# Altium schematic sheet stm32n657.SchDoc
size C
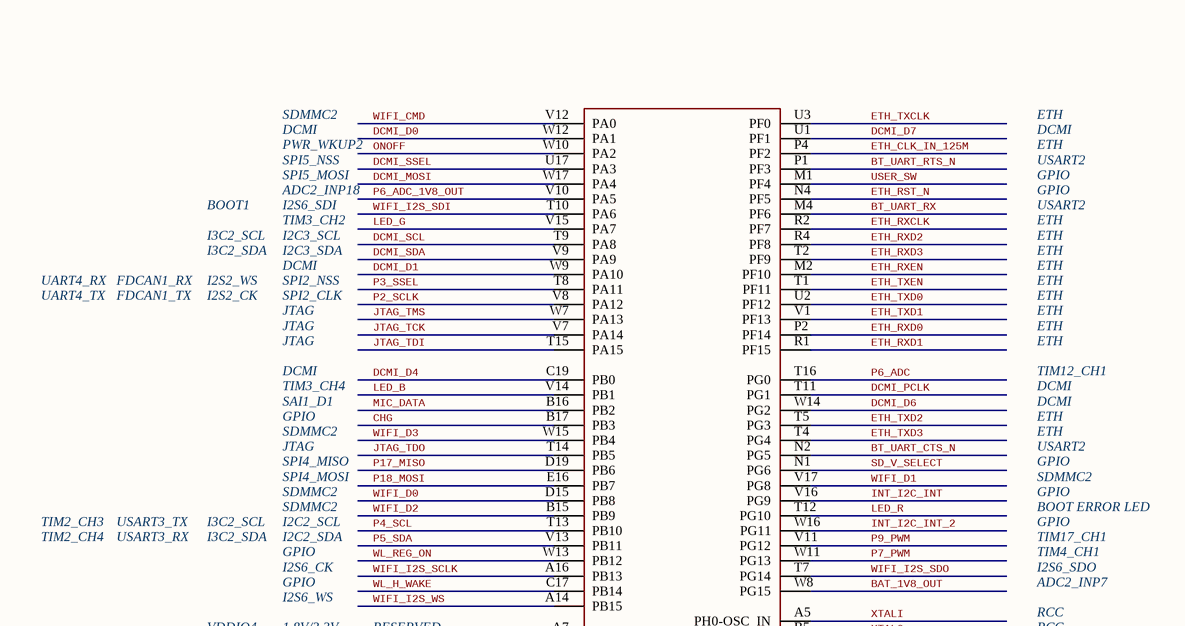
[diagram p0: stm32n657.SchDoc, top left]
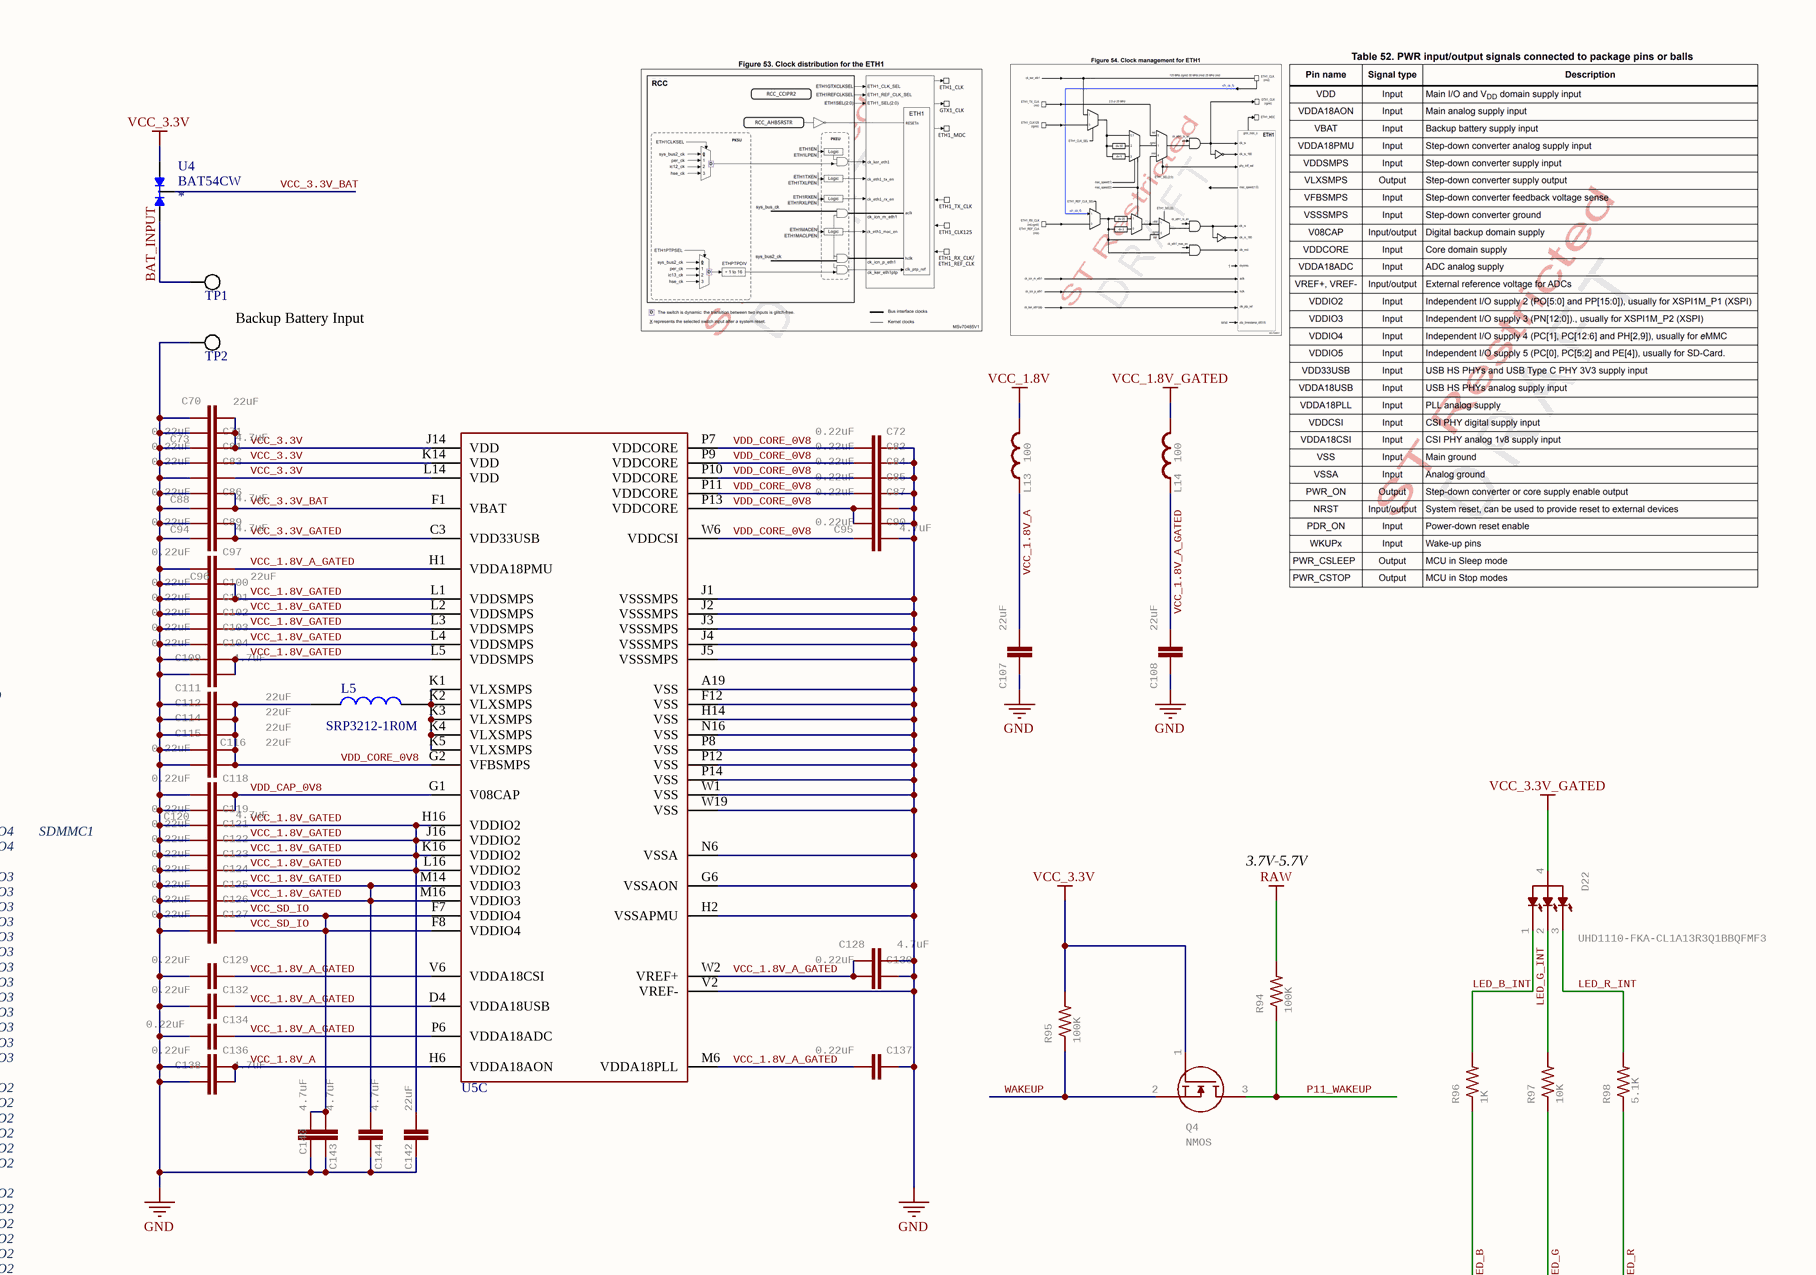
[diagram p1: stm32n657.SchDoc, top right]
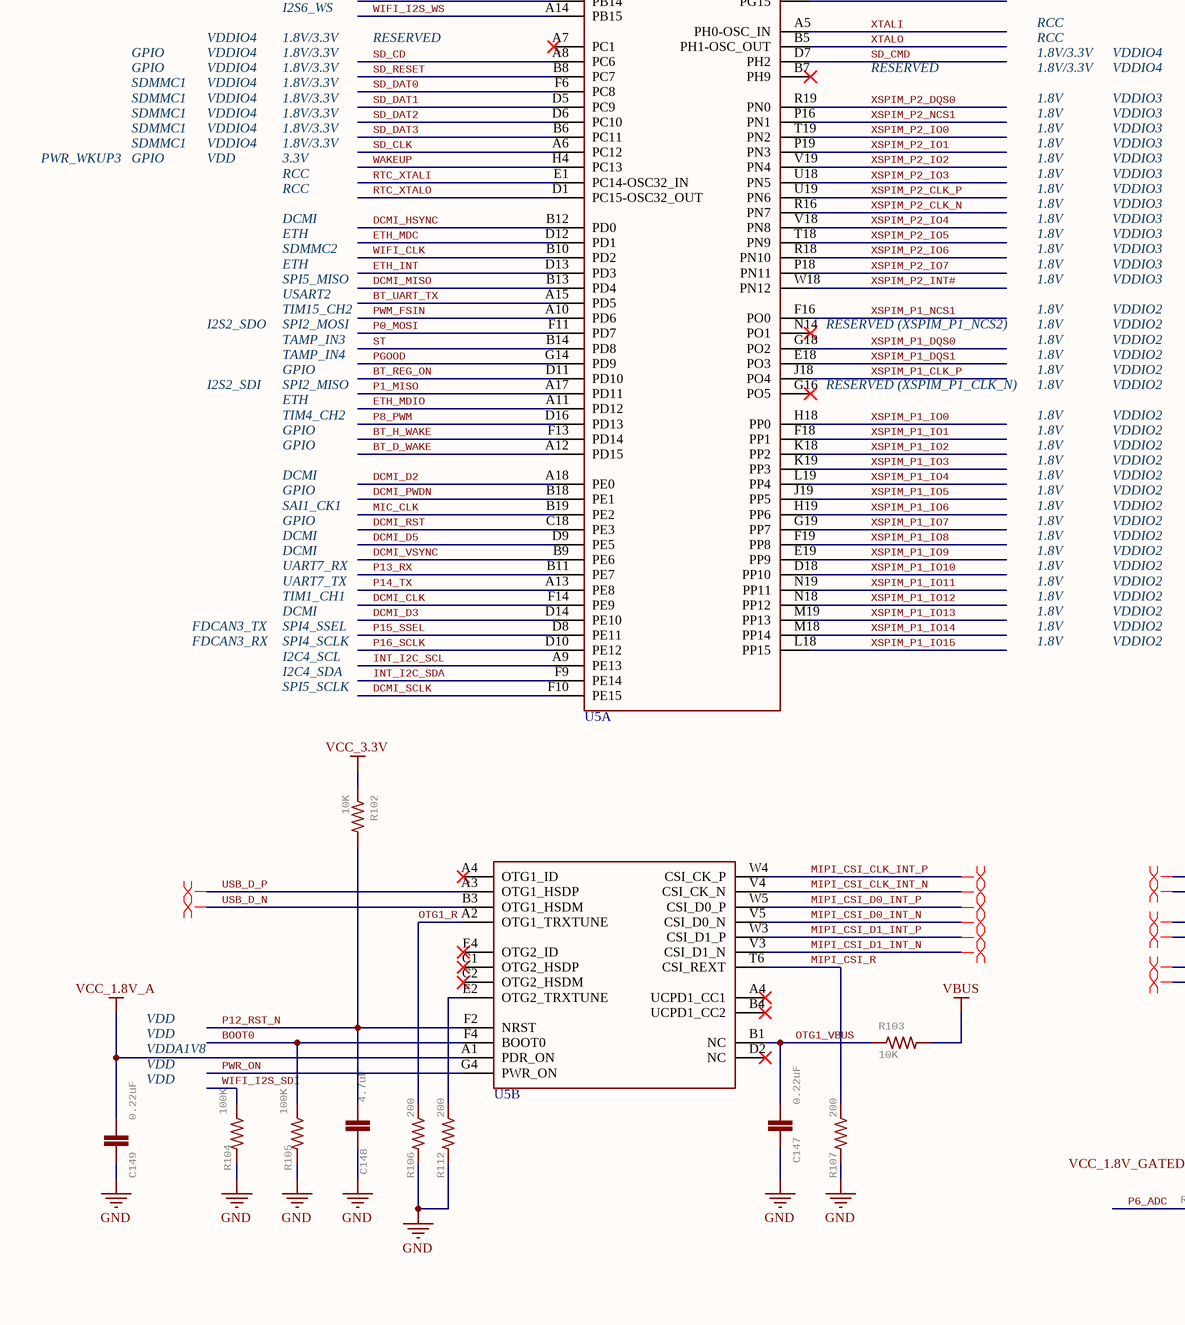
[diagram p2: stm32n657.SchDoc, bottom left]
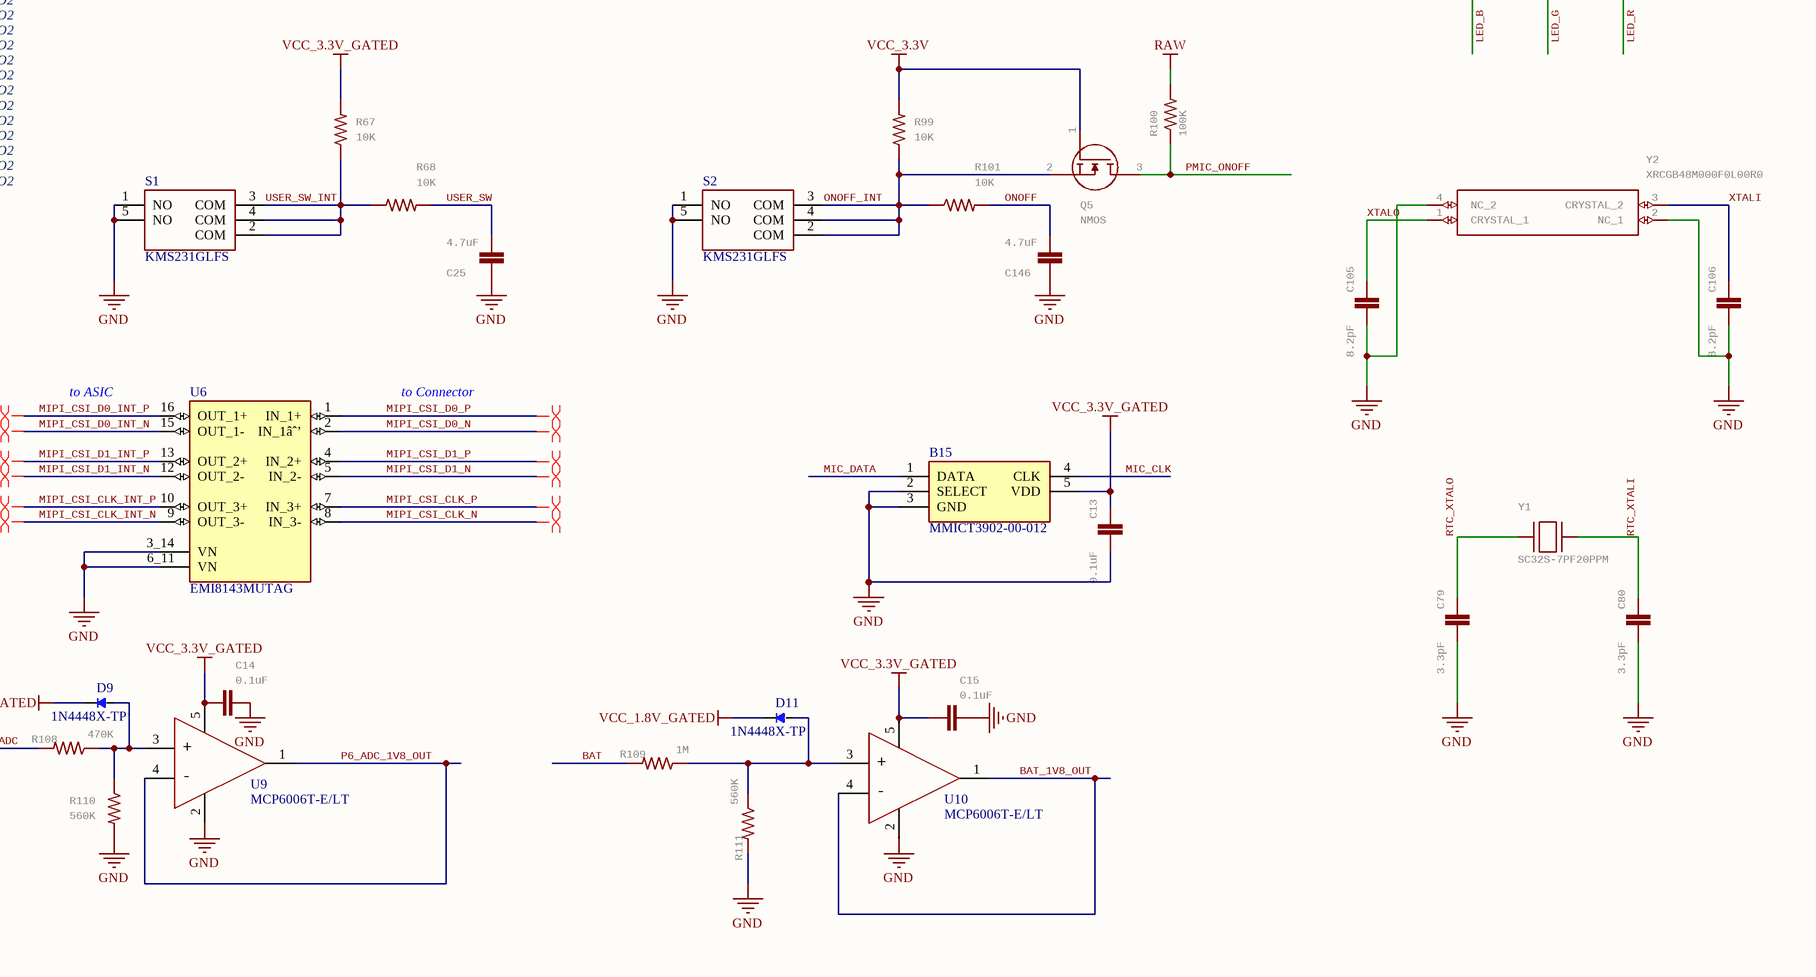
[diagram p3: stm32n657.SchDoc, bottom right]

## Parts
B15  MMICT3902-00-012  [MMICT390200012]
C13  0.1uF  [0402-CAP]
C14  0.1uF  [0402-CAP]
C15  0.1uF  [0402-CAP]
C25  4.7uF  [0402-CAP]
C70  22uF  [0805]
C71  0.22uF  [C0201]
C72  0.22uF  [C0201]
C73  4.7uF  [0402-CAP]
C79  3.3pF  [C0201]
C80  3.3pF  [C0201]
C81  0.22uF  [C0201]
C82  0.22uF  [C0201]
C83  0.22uF  [C0201]
C84  0.22uF  [C0201]
C85  0.22uF  [C0201]
C86  0.22uF  [C0201]
C87  0.22uF  [C0201]
C88  4.7uF  [0402-CAP]
C89  0.22uF  [C0201]
C90  0.22uF  [C0201]
C94  4.7uF  [0402-CAP]
C95  4.7uF  [0402-CAP]
C96  22uF  [0805]
C97  0.22uF  [C0201]
C100  0.22uF  [C0201]
C101  0.22uF  [C0201]
C102  0.22uF  [C0201]
C103  0.22uF  [C0201]
C104  0.22uF  [C0201]
C105  8.2pF  [C0201]
C106  8.2pF  [C0201]
C107  22uF  [0805]
C108  22uF  [0805]
C109  4.7uF  [0402-CAP]
C111  22uF  [0805]
C112  22uF  [0805]
C114  22uF  [0805]
C115  22uF  [0805]
C116  0.22uF  [C0201]
C118  0.22uF  [C0201]
C119  0.22uF  [C0201]
C120  4.7uF  [0402-CAP]
C121  0.22uF  [C0201]
C122  0.22uF  [C0201]
C123  0.22uF  [C0201]
C124  0.22uF  [C0201]
C125  0.22uF  [C0201]
C126  0.22uF  [C0201]
C127  0.22uF  [C0201]
C128  4.7uF  [0402-CAP]
C129  0.22uF  [C0201]
C130  0.22uF  [C0201]
C132  0.22uF  [C0201]
C134  0.22uF  [C0201]
C136  0.22uF  [C0201]
C137  0.22uF  [C0201]
C138  4.7uF  [0402-CAP]
C140  4.7uF  [0402-CAP]
C142  22uF  [0805]
C143  4.7uF  [0402-CAP]
C144  4.7uF  [0402-CAP]
C146  4.7uF  [0402-CAP]
C147  0.22uF  [C0201]
C148  4.7uF  [0402-CAP]
C149  0.22uF  [C0201]
D9  MPN: 1N4448X-TP  [SOD523]  (hidden comment: DIODE_GP)
D11  MPN: 1N4448X-TP  [SOD523]  (hidden comment: DIODE_GP)
D22  UHD1110-FKA-CL1A13R3Q1BBQFMF3  [LED_UHD1110-FKA-CL1A13R3Q1BBQFMF3]
L5  SRP3212-1R0M  [IND3225X100N]
L13  100  [C0402]
L14  100  [C0402]
Q4  NMOS  [DFN1006]
Q5  NMOS  [DFN1006]
R67  10K  [0402-RES]
R68  10K  [0402-RES]
R94  100K  [0402-RES]
R95  100K  [0402-RES]
R96  1K  [0402-RES]
R97  10K  [0402-RES]
R98  5.1K  [0402-RES]
R99  10K  [0402-RES]
R100  100K  [0402-RES]
R101  10K  [0402-RES]
R102  10K  [0402-RES]
R103  10K  [0402-RES]
R104  100K  [0402-RES]
R105  100K  [0402-RES]
R106  200  [R0201]
R107  200  [R0201]
R108  470K  [0402-RES]
R109  1M  [0402-RES]
R110  560K  [0402-RES]
R111  560K  [0402-RES]
R112  200  [R0201]
S1  KMS231GLFS  [KMS231GLFS]
S2  KMS231GLFS  [KMS231GLFS]
TP1  TP  [TP_1p8]  (value not drawn)  (no BOM)
TP2  TP  [TP_1p8]  (value not drawn)  (no BOM)
U4  BAT54CW  [SOT65P210X110-3N]
U5  STM32N657_223  [STM32N657_VFBGA223]  (value not drawn)  (parts A,B,C of 3)
U6  EMI8143MUTAG  [IC_EMI8143MUTAG]
U9  MCP6006T-E/LT  [SC70-5]
U10  MCP6006T-E/LT  [SC70-5]
Y1  SC32S-7PF20PPM  [XTAL_ABS07-32.768KHZ-7-T]
Y2  XRCGB48M000F0L00R0  [XRCGB24M000F3M00R0]

## Nets
GND: B15.2(SELECT) B15.3(GND) C13.2 C14.2 C15.2 C25.1 C70.1 C71.2 C72.1 C73.2 C79.2 C80.2 C81.2 C82.1 C83.2 C84.1 C85.1 C86.2 C87.1 C88.2 C89.2 C90.1 C94.2 C95.1 C96.1 C97.2 C100.2 C101.2 C102.2 C103.2 C104.2 C105.2 C106.2 C107.1 C108.1 C109.1 C111.1 C112.1 C114.1 C115.1 C116.2 C118.2 C119.2 C120.2 C121.2 C122.2 C123.2 C124.2 C125.2 C126.2 C127.2 C128.2 C129.2 C130.1 C132.2 C134.2 C136.2 C137.1 C138.1 C140.2 C142.1 C143.2 C144.2 C146.1 C147.1 C148.2 C149.1 R104.2 R105.2 R106.2 R107.2 R110.2 R111.2 R112.2 S1.1(NO) S1.5(NO) S2.1(NO) S2.5(NO) TP2.1 U5.A19(VSS) U5.F12(VSS) U5.G6(VSSAON) U5.H2(VSSAPMU) U5.H14(VSS) U5.J1(VSSSMPS) U5.J2(VSSSMPS) U5.J3(VSSSMPS) U5.J4(VSSSMPS) U5.J5(VSSSMPS) U5.N6(VSSA) U5.N16(VSS) U5.P8(VSS) U5.P12(VSS) U5.P14(VSS) U5.V2(VREF-) U5.W1(VSS) U5.W19(VSS) U6.3_14(VN) U6.6_11(VN) U9.2(GND) U10.2(GND) Y2.2(NC_1) Y2.4(NC_2)
RAW: R94.2 R100.2
VBUS: R103.2
VCC_1.8V: L13.2
VCC_1.8V_A: C107.2 C136.1 C138.2 C149.2 L13.1 U5.A1(PDR_ON) U5.H6(VDDA18AON)
VCC_1.8V_GATED: C96.2 C100.1 C101.1 C102.1 C103.1 C104.1 C109.2 C119.1 C121.1 C122.1 C123.1 C124.1 C125.1 C142.2 C144.1 D9.1 D11.1 L14.2 U5.H16(VDDIO2) U5.J16(VDDIO2) U5.K16(VDDIO2) U5.L1(VDDSMPS) U5.L2(VDDSMPS) U5.L3(VDDSMPS) U5.L4(VDDSMPS) U5.L5(VDDSMPS) U5.L16(VDDIO2) U5.M14(VDDIO3) U5.M16(VDDIO3)
VCC_3.3V: C70.2 C71.1 C73.1 C81.1 C83.1 Q4.1(G) Q5.1(G) R95.2 R99.2 R102.1 U4.1 U5.J14(VDD) U5.K14(VDD) U5.L14(VDD)
VCC_3.3V_GATED: B15.5(VDD) C13.1 C14.1 C15.1 C89.1 C94.1 D22.4(ANODE) R67.2 U5.C3(VDD33USB) U9.5(VDD) U10.5(VDD)
BAT: R109.2
BAT_1V8_OUT: U5.W8(PG15) U10.1(OUT) U10.4(IN-)
BAT_INPUT: TP1.1 U4.2
BOOT0: R105.1 U5.F4(BOOT0)
BT_D_WAKE: U5.A12(PD15)
BT_H_WAKE: U5.F13(PD14)
BT_REG_ON: U5.D11(PD10)
BT_UART_CTS_N: U5.N2(PG5)
BT_UART_RTS_N: U5.P1(PF3)
BT_UART_RX: U5.M4(PF6)
BT_UART_TX: U5.A15(PD5)
CHG: U5.B17(PB3)
DCMI_CLK: U5.F14(PE9)
DCMI_D0: U5.W12(PA1)
DCMI_D1: U5.W9(PA10)
DCMI_D2: U5.A18(PE0)
DCMI_D3: U5.D14(PE10)
DCMI_D4: U5.C19(PB0)
DCMI_D5: U5.D9(PE5)
DCMI_D6: U5.W14(PG2)
DCMI_D7: U5.U1(PF1)
DCMI_HSYNC: U5.B12(PD0)
DCMI_MISO: U5.B13(PD4)
DCMI_MOSI: U5.W17(PA4)
DCMI_PCLK: U5.T11(PG1)
DCMI_PWDN: U5.B18(PE1)
DCMI_RST: U5.C18(PE3)
DCMI_SCL: U5.T9(PA8)
DCMI_SCLK: U5.F10(PE15)
DCMI_SDA: U5.V9(PA9)
DCMI_SSEL: U5.U17(PA3)
DCMI_VSYNC: U5.B9(PE6)
ETH_CLK_IN_125M: U5.P4(PF2)
ETH_INT: U5.D13(PD3)
ETH_MDC: U5.D12(PD1)
ETH_MDIO: U5.A11(PD12)
ETH_RST_N: U5.N4(PF5)
ETH_RXCLK: U5.R2(PF7)
ETH_RXD0: U5.P2(PF14)
ETH_RXD1: U5.R1(PF15)
ETH_RXD2: U5.R4(PF8)
ETH_RXD3: U5.T2(PF9)
ETH_RXEN: U5.M2(PF10)
ETH_TXCLK: U5.U3(PF0)
ETH_TXD0: U5.U2(PF12)
ETH_TXD1: U5.V1(PF13)
ETH_TXD2: U5.T5(PG3)
ETH_TXD3: U5.T4(PG4)
ETH_TXEN: U5.T1(PF11)
INT_I2C_INT: U5.V16(PG9)
INT_I2C_INT_2: U5.W16(PG11)
INT_I2C_SCL: U5.A9(PE13)
INT_I2C_SDA: U5.F9(PE14)
JTAG_TCK: U5.V7(PA14)
JTAG_TDI: U5.T15(PA15)
JTAG_TDO: U5.T14(PB5)
JTAG_TMS: U5.W7(PA13)
LED_B: R96.1 U5.V14(PB1)
LED_B_INT: D22.1(BLUE) R96.2
LED_G: R97.1 U5.V15(PA7)
LED_G_INT: D22.2(GREEN) R97.2
LED_R: R98.1 U5.T12(PG10)
LED_R_INT: D22.3(RED) R98.2
MIC_CLK: B15.4(CLK) U5.B19(PE2)
MIC_DATA: B15.1(DATA) U5.B16(PB2)
MIPI_CSI_CLK_INT_N: U5.V4(CSI_CK_N) U6.9(OUT_3-)
MIPI_CSI_CLK_INT_P: U5.W4(CSI_CK_P) U6.10(OUT_3+)
MIPI_CSI_CLK_N: U6.8(IN_3-)
MIPI_CSI_CLK_P: U6.7(IN_3+)
MIPI_CSI_D0_INT_N: U5.V5(CSI_D0_N) U6.15(OUT_1-)
MIPI_CSI_D0_INT_P: U5.W5(CSI_D0_P) U6.16(OUT_1+)
MIPI_CSI_D0_N: U6.2(IN_1âˆ’)
MIPI_CSI_D0_P: U6.1(IN_1+)
MIPI_CSI_D1_INT_N: U5.V3(CSI_D1_N) U6.12(OUT_2-)
MIPI_CSI_D1_INT_P: U5.W3(CSI_D1_P) U6.13(OUT_2+)
MIPI_CSI_D1_N: U6.5(IN_2-)
MIPI_CSI_D1_P: U6.4(IN_2+)
MIPI_CSI_R: R107.1 U5.T6(CSI_REXT)
ONOFF: C146.2 R101.2 U5.W10(PA2)
ONOFF_INT: Q5.2(S) R99.1 R101.1 S2.2(COM) S2.3(COM) S2.4(COM)
OTG1_R: R106.1 U5.A2(OTG1_TRXTUNE)
OTG1_VBUS: C147.2 R103.1 U5.B1(NC)
P0_MOSI: U5.F11(PD7)
P1_MISO: U5.A17(PD11)
P2_SCLK: U5.V8(PA12)
P3_SSEL: U5.T8(PA11)
P4_SCL: U5.T13(PB10)
P5_SDA: U5.V13(PB11)
P6_ADC: R108.2 U5.T16(PG0)
P6_ADC_1V8_OUT: U5.V10(PA5) U9.1(OUT) U9.4(IN-)
P7_PWM: U5.W11(PG13)
P8_PWM: U5.D16(PD13)
P9_PWM: U5.V11(PG12)
P11_WAKEUP: Q4.3(D) R94.1
P12_RST_N: C148.1 R102.2 U5.F2(NRST)
P13_RX: U5.B11(PE7)
P14_TX: U5.A13(PE8)
P15_SSEL: U5.D8(PE11)
P16_SCLK: U5.D10(PE12)
P17_MISO: U5.D19(PB6)
P18_MOSI: U5.E16(PB7)
PGOOD: U5.G14(PD9)
PMIC_ONOFF: Q5.3(D) R100.1
PWM_FSIN: U5.A10(PD6)
PWR_ON: U5.G4(PWR_ON)
RTC_XTALI: C80.1 U5.E1(PC14-OSC32_IN) Y1.2
RTC_XTALO: C79.1 U5.D1(PC15-OSC32_OUT) Y1.1
SD_CD: U5.A8(PC6)
SD_CLK: U5.A6(PC12)
SD_CMD: U5.D7(PH2)
SD_DAT0: U5.F6(PC8)
SD_DAT1: U5.D5(PC9)
SD_DAT2: U5.D6(PC10)
SD_DAT3: U5.B6(PC11)
SD_RESET: U5.B8(PC7)
SD_V_SELECT: U5.N1(PG6)
ST: U5.B14(PD8)
USB_D_N: U5.B3(OTG1_HSDM)
USB_D_P: U5.A3(OTG1_HSDP)
USER_SW: C25.2 R68.2 U5.M1(PF4)
USER_SW_INT: R67.1 R68.1 S1.2(COM) S1.3(COM) S1.4(COM)
VCC_1.8V_A_GATED: C97.1 C108.2 C128.1 C129.1 C130.2 C132.1 C134.1 C137.2 L14.1 U5.D4(VDDA18USB) U5.H1(VDDA18PMU) U5.M6(VDDA18PLL) U5.P6(VDDA18ADC) U5.V6(VDDA18CSI) U5.W2(VREF+)
VCC_3.3V_BAT: C86.1 C88.1 U4.3 U5.F1(VBAT)
VCC_SD_IO: C126.1 C127.1 C140.1 C143.1 U5.F7(VDDIO4) U5.F8(VDDIO4)
VDD_CAP_0V8: C118.1 C120.1 U5.G1(V08CAP)
VDD_CORE_0V8: C72.2 C82.2 C84.2 C85.2 C87.2 C90.2 C95.2 C111.2 C112.2 C114.2 C115.2 C116.1 L5.1 U5.G2(VFBSMPS) U5.P7(VDDCORE) U5.P9(VDDCORE) U5.P10(VDDCORE) U5.P11(VDDCORE) U5.P13(VDDCORE) U5.W6(VDDCSI)
WAKEUP: Q4.2(S) R95.1 U5.H4(PC13)
WIFI_CLK: U5.B10(PD2)
WIFI_CMD: U5.V12(PA0)
WIFI_D0: U5.D15(PB8)
WIFI_D1: U5.V17(PG8)
WIFI_D2: U5.B15(PB9)
WIFI_D3: U5.W15(PB4)
WIFI_I2S_SCLK: U5.A16(PB13)
WIFI_I2S_SDI: R104.1 U5.T10(PA6)
WIFI_I2S_SDO: U5.T7(PG14)
WIFI_I2S_WS: U5.A14(PB15)
WL_H_WAKE: U5.C17(PB14)
WL_REG_ON: U5.W13(PB12)
XSPIM_P1_CLK_P: U5.J18(PO4)
XSPIM_P1_DQS0: U5.G18(PO2)
XSPIM_P1_DQS1: U5.E18(PO3)
XSPIM_P1_IO0: U5.H18(PP0)
XSPIM_P1_IO1: U5.F18(PP1)
XSPIM_P1_IO2: U5.K18(PP2)
XSPIM_P1_IO3: U5.K19(PP3)
XSPIM_P1_IO4: U5.L19(PP4)
XSPIM_P1_IO5: U5.J19(PP5)
XSPIM_P1_IO6: U5.H19(PP6)
XSPIM_P1_IO7: U5.G19(PP7)
XSPIM_P1_IO8: U5.F19(PP8)
XSPIM_P1_IO9: U5.E19(PP9)
XSPIM_P1_IO10: U5.D18(PP10)
XSPIM_P1_IO11: U5.N19(PP11)
XSPIM_P1_IO12: U5.N18(PP12)
XSPIM_P1_IO13: U5.M19(PP13)
XSPIM_P1_IO14: U5.M18(PP14)
XSPIM_P1_IO15: U5.L18(PP15)
XSPIM_P1_NCS1: U5.F16(PO0)
XSPIM_P2_CLK_N: U5.R16(PN7)
XSPIM_P2_CLK_P: U5.U19(PN6)
XSPIM_P2_DQS0: U5.R19(PN0)
XSPIM_P2_INT#: U5.W18(PN12)
XSPIM_P2_IO0: U5.T19(PN2)
XSPIM_P2_IO1: U5.P19(PN3)
XSPIM_P2_IO2: U5.V19(PN4)
XSPIM_P2_IO3: U5.U18(PN5)
XSPIM_P2_IO4: U5.V18(PN8)
XSPIM_P2_IO5: U5.T18(PN9)
XSPIM_P2_IO6: U5.R18(PN10)
XSPIM_P2_IO7: U5.P18(PN11)
XSPIM_P2_NCS1: U5.P16(PN1)
XTALI: C106.1 U5.A5(PH0-OSC_IN) Y2.3(CRYSTAL_2)
XTALO: C105.1 U5.B5(PH1-OSC_OUT) Y2.1(CRYSTAL_1)
NetD9_2: D9.2 R108.1 R110.1 U9.3(IN+)
NetD11_2: D11.2 R109.1 R111.1 U10.3(IN+)
NetL5_2: L5.2 U5.K1(VLXSMPS) U5.K2(VLXSMPS) U5.K3(VLXSMPS) U5.K4(VLXSMPS) U5.K5(VLXSMPS)
NetR112_1: R112.1 U5.E2(OTG2_TRXTUNE)

Not connected (* = marked no-connect by the designer): U5 A4(UCPD1_CC1)* A7(PC1)* B4(UCPD1_CC2)* B7(PH9)* C1(OTG2_HSDP)* C2(OTG2_HSDM)* D2(NC)* E4(OTG2_ID)* G16(PO5)* N14(PO1)*

## Layout directives
differential pair; differential pair class MIPI: MIPI_CSI_CLK_INT_N, MIPI_CSI_CLK_INT_P, MIPI_CSI_CLK_N, MIPI_CSI_CLK_P, MIPI_CSI_D0_INT_N, MIPI_CSI_D0_INT_P, MIPI_CSI_D0_N, MIPI_CSI_D0_P, MIPI_CSI_D1_INT_N, MIPI_CSI_D1_INT_P, MIPI_CSI_D1_N, MIPI_CSI_D1_P, USB_D_N, USB_D_P

## Notes on the sheet
- SDMMC2
- ETH
- ADC2_INP18
- SPI5_NSS
- SPI5_MOSI
- PWR_WKUP2
- DCMI
- USART2
- GPIO
- Backup Battery Input
- I3C2_SCL
- I3C2_SDA
- BOOT1
- I2C3_SCL
- I2C3_SDA
- TIM3_CH2
- I2S6_SDI
- UART4_TX
- UART4_RX
- FDCAN1_RX
- FDCAN1_TX
- I2S2_WS
- I2S2_CK
- SPI2_NSS
- SPI2_CLK
- JTAG
- TIM3_CH4
- SAI1_D1
- TIM12_CH1
- SPI4_MOSI
- SPI4_MISO
- TIM2_CH3
- TIM2_CH4
- USART3_TX
- USART3_RX
- I2C2_SCL
- I2C2_SDA
- I2S6_CK
- BOOT ERROR LED
- I2S6_SDO
- TIM4_CH1
- TIM17_CH1
- VDDIO4
- 1.8V/3.3V
- I2S6_WS
- RESERVED
- ADC2_INP7
- RCC
- SDMMC1
- 1.8V
- VDDIO3
- 3.7V-5.7V
- PWR_WKUP3
- VDD
- 3.3V
- SPI5_MISO
- I2S2_SDO
- SPI2_MOSI
- TIM15_CH2
- TAMP_IN3
- TAMP_IN4
- (near U5) RESERVED (XSPIM_P1_NCS2)
- VDDIO2
- I2S2_SDI
- SPI2_MISO
- TIM4_CH2
- (near U5) RESERVED (XSPIM_P1_CLK_N)
- SAI1_CK1
- UART7_TX
- UART7_RX
- FDCAN3_TX
- FDCAN3_RX
- SPI4_SSEL
- SPI4_SCLK
- I2C4_SCL
- TIM1_CH1
- I2C4_SDA
- SPI5_SCLK
- to ASIC
- to Connector
- VDDA1V8
- (in symbol MCP6006T-E/LT) +; -

## Library data of the parts
B15 = MMICT3902-00-012: Mic Omni-Directional -26dB Rectangle Solder Pad; Manufacturer_Name: TDK; Geometry.Height: 1.13mm; Mouser Part Number: 410-MMICT3902-00-012; Mouser Price/Stock: https://www.mouser.co.uk/ProductDetail/TDK-InvenSense/MMICT3902-00-012?qs=yqaQSyyJnNi1lpqXyrpxOA%3D%3D; Manufacturer_Part_Number: MMICT3902-00-012; Datasheet Link: http://invensense.tdk.com/wp-content/uploads/2020/05/DS-000357-T3902-v1.0.pdf; Part Number: MMICT3902-00-012; MPN: MMICT3902-00-012
C13-C15 = C-EUC0201: CAPACITOR, European symbol; MPN: C0402C104Z4VAC; GateName_1: G$1; SymbolName_1: C-EU; POPULARITY: 0; LibraryName: rcl; DeviceSetName: C-EU; SPICEPREFIX: C; Part Number: C0402C104Z4VAC
C25 C73 C88 C94 C95 C109 C120 C128 C138 C140 C143 C144 C146 C148 = CAP0402-CAP: CapacitorStandard 0603 ceramic capacitor, and 0.1" leaded capacitor.; MPN: JMK105BBJ475MV-F; GateName_1: G$1; SymbolName_1: CAP; DeviceName: 0402-CAP; LibraryName: sfe; DeviceSetName: CAP; Part Number: JMK105BBJ475MV-F
C70 C96 C107 C108 C111 C112 C114 C115 C142 = 22UF-0805-6.3V-20%: 22ÂµF ceramic capacitors    A capacitor is a passive two-terminal electrical component used to store electrical energy temporarily in an electric field.; MPN: CL21A226MQQNNNE; GateName_1: G$1; SymbolName_1: CAP; PROD_ID: CAP-08402; DeviceName: -0805-6.3V-20%; LibraryName: SparkFun-Capacitors; DeviceSetName: 22UF; Part Number: CL21A226MQQNNNE
C71 C72 C81-C87 C89 C90 C97 C100-C104 C116 C118 C119 C121-C127 C129 C130 C132 C134 C136 C137 C147 C149 = C-EUC0201: CAPACITOR, European symbol; MPN: GRM033R60J224ME15D; GateName_1: G$1; SymbolName_1: C-EU; POPULARITY: 0; DeviceName: C0201; LibraryName: rcl; DeviceSetName: C-EU; SPICEPREFIX: C; Part Number: GRM033R60J224ME15D
C79 C80 = C-EUC0201: CAPACITOR, European symbol; MPN: GRM0335C1H3R3CA01D; GateName_1: G$1; SymbolName_1: C-EU; POPULARITY: 0; DeviceName: C0201; LibraryName: rcl; DeviceSetName: C-EU; SPICEPREFIX: C; Part Number: GRM0335C1H3R3CA01D
C105 C106 = C-EUC0201: CAPACITOR, European symbol; MPN: GRM0335C1H8R2CA01D; GateName_1: G$1; SymbolName_1: C-EU; POPULARITY: 0; DeviceName: C0201; LibraryName: rcl; DeviceSetName: C-EU; SPICEPREFIX: C; Part Number: GRM0335C1H8R2CA01D
D22 = UHD1110-FKA-CL1A13R3Q1BBQFMF3: LED RGB SMD, SIZE 1 X 1 mm Check availability; GateName_1: G$1; MF: Cree Inc.; SymbolName_1: UHD1110-FKA-CL1A13R3Q1BBQFMF3; LibraryName: UHD1110-FKA-CL1A13R3Q1BBQFMF3; DeviceSetName: UHD1110-FKA-CL1A13R3Q1BBQFMF3; AVAILABILITY: In Stock; MP: UHD1110-FKA-CL1A13R3Q1BBQFMF3; MPN: UHD1110-FKA-CL1A13r3q1BBQFMF3; PACKAGE: 0404 Cree Inc.; PRICE: None; PURCHASE-URL: https://pricing.snapeda.com/search/part/UHD1110-FKA-CL1A13R3Q1BBQFMF3/?ref=eda; Part Number: UHD1110-FKA-CL1A13r3q1BBQFMF3
L5 = SRP3212-2R2M: Ind,3.2x2.5x1mm,1.0uH?20%,6.5A,shd; Manufacturer_Name: Bourns; Geometry.Height: 1mm; Mouser Part Number: 652-SRP3212-1R0M; Mouser Price/Stock: https://www.mouser.com/ProductDetail/Bourns/SRP3212-1R0M?qs=t7xnP681wgVwh6hWpVPUMg%3D%3D; Manufacturer_Part_Number: SRP3212-1R0M; Datasheet Link: https://www.bourns.com/pdfs/CVH.pdf; Part Number: SRP3212-1R0M; MPN: SRP3212-1R0M
L13 L14 = INDUCTOR0402: InductorsBasic Inductor/Choke - 0603 and 1206. Footprints are not proven and vary greatly between part numbers.; MPN: MFBM1V1005-101-R; GateName_1: G$1; DeviceName: 0402; SymbolName_1: INDUCTOR; LibraryName: sfe; DeviceSetName: INDUCTOR; Part Number: MFBM1V1005-101-R
Q4 Q5 = 2N7002KW_R1_00001: MOSFET 60V N-Channel Enhancement Mode MOSFET - ESD Protected   Source:  Datasheet
R67 R68 R99 R101 = RESISTOR0402-RES: ResistorBasic schematic elements and footprints for 0603, 1206, and PTH resistors.; MPN: AC0402FR-1310K; GateName_1: G$1; SymbolName_1: RESISTOR; DeviceName: 0402-RES; LibraryName: sfe; DeviceSetName: RESISTOR; Part Number: AC0402FR-1310K
R94 R95 R100 R104 R105 = RESISTOR0402-RES: ResistorBasic schematic elements and footprints for 0603, 1206, and PTH resistors.; MPN: AC0402FR-07100KL; GateName_1: G$1; SymbolName_1: RESISTOR; DeviceName: 0402-RES; LibraryName: sfe; DeviceSetName: RESISTOR; Part Number: AC0402FR-07100KL
R96 = RESISTOR0402-RES: ResistorBasic schematic elements and footprints for 0603, 1206, and PTH resistors.; MPN: CRCW04021K00FKEDC; GateName_1: G$1; SymbolName_1: RESISTOR; DeviceName: 0402-RES; LibraryName: sfe; DeviceSetName: RESISTOR; Part Number: CRCW04021K00FKEDC
R97 R102 R103 = RESISTOR0402-RES: ResistorBasic schematic elements and footprints for 0603, 1206, and PTH resistors.; MPN: AC0402FR-1310KL; GateName_1: G$1; SymbolName_1: RESISTOR; DeviceName: 0402-RES; LibraryName: sfe; DeviceSetName: RESISTOR; Part Number: AC0402FR-1310KL
R98 = RESISTOR0402-RES: ResistorBasic schematic elements and footprints for 0603, 1206, and PTH resistors.; MPN: RC0402JR-075K1L; GateName_1: G$1; SymbolName_1: RESISTOR; DeviceName: 0402-RES; LibraryName: sfe; DeviceSetName: RESISTOR; Part Number: RC0402JR-075K1L
R106 R107 R112 = RESISTOR0402-RES: MPN: CR0201-FW-2000GLF; GateName_1: G$1; SymbolName_1: RESISTOR; LibraryName: sfe; DeviceSetName: RESISTOR; Part Number: CR0201-FW-2000GLF
R108 = RESISTOR0402-RES: ResistorBasic schematic elements and footprints for 0603, 1206, and PTH resistors.; MPN: RC0402FR-7D470KL; GateName_1: G$1; SymbolName_1: RESISTOR; DeviceName: 0402-RES; LibraryName: sfe; DeviceSetName: RESISTOR; Part Number: RC0402FR-7D470KL
R109 = RESISTOR0402-RES: ResistorBasic schematic elements and footprints for 0603, 1206, and PTH resistors.; MPN: CRCW04021M00FKEDC; GateName_1: G$1; SymbolName_1: RESISTOR; DeviceName: 0402-RES; LibraryName: sfe; DeviceSetName: RESISTOR; Part Number: CRCW04021M00FKEDC
R110 R111 = RESISTOR0402-RES: ResistorBasic schematic elements and footprints for 0603, 1206, and PTH resistors.; MPN: RMCF0402FT560K; GateName_1: G$1; SymbolName_1: RESISTOR; DeviceName: 0402-RES; LibraryName: sfe; DeviceSetName: RESISTOR; Part Number: RMCF0402FT560K
U4 = BAT54CW: Diode Array 1 Pair Common Cathode Schottky 30 V 200mA (DC) Surface Mount SC-70, SOT-323; Part Number: BAT54CW,115; MF: ON Semiconductor; SnapEDA_Link: https://www.snapeda.com/parts/BAT54CW/Onsemi/view-part/?ref=snap; MP: BAT54CW; Purchase-URL: https://pricing.snapeda.com/search/part/BAT54CW/?ref=eda; Check_prices: https://www.snapeda.com/parts/BAT54CW/Onsemi/view-part/?ref=eda; Component Type: Standard; Availability: In Stock; Package: SC-70 NXP Semiconductors; Source: BAT54CW.SchLib; Design Item ID: BAT54CW; Price: None; Pin Count: 3; MPN: BAT54CW,115; Value: *
U6 = CMP-008-000000-1: 6 Line Common Mode Choke Surface Mount 100mA DCR 6Ohm (Typ); MF: ON Semiconductor; Design Item ID: EMI8143MUTAG; Source: EMI8143MUTAG.SchLib; Package: XDFN-16 ON Semiconductor; Pin Count: 14; MP: EMI8143MUTAG; Component Type: Standard; Digi-Key_Part_Number: EMI8143MUTAGOSCT-ND; Value: *; SnapEDA_Link: https://www.snapeda.com/parts/EMI8143MUTAG/ON%20Semiconductor/view-part/182093/?ref=snap; Purchase-URL: https://pricing.snapeda.com/search/part/EMI8143MUTAG/?ref=eda; MPN: EMI8143MUTAG; Part Number: EMI8143MUTAG
U9 U10 = MCP6006T-E/LT: MF: Microchip; MPN: MCP6006T-E/LT
Y1 = ABS07-32.768KHZ-7-T: Check availability; GateName_1: G$1; MF: Abracon; SymbolName_1: ABS07-32.768KHZ-7-T; LibraryName: ABS07-32.768KHZ-7-T; DeviceSetName: ABS07-32.768KHZ-7-T; AVAILABILITY: In Stock; MP: ABS07-32.768KHZ-7-T; MPN: SC32S-7PF20PPM; PACKAGE: SMD-2 Abracon LLC; PRICE: None; PURCHASE-URL: https://pricing.snapeda.com/search/part/ABS07-32.768KHZ-7-T/?ref=eda; Part Number: SC32S-7PF20PPM
Y2 = XRCGB24M000F3M00R0: Murata 48MHz Crystal +/-30ppm SMD 4-Pin 2 x 1.6 x 0.7mm   Source:  Datasheet; MANUFACTURER_NAME: Murata Electronics; GateName_1: G$1; SymbolName_1: XRCGB48M000F0L00R0; LibraryName: XRCGB48M000F0L00R0; DeviceSetName: XRCGB48M000F0L00R0; HEIGHT: mm; MANUFACTURER_PART_NUMBER: XRCGB48M000F0L00R0; MOUSER_PART_NUMBER: 81-XRCGB48M000F0L00R0; MOUSER_PRICE-STOCK: https://www.mouser.com/ProductDetail/Murata-Electronics/XRCGB48M000F0L00R0?qs=e%252BE4OD6MgMeeUSmgUp7uPA%3D%3D; MPN: XRCGB48M000F0L00R0; Part Number: XRCGB48M000F0L00R0
D9 D11 = DIODE_GP: MF: *
S1 S2 = KMS231GLFS: Part Number: KMS231GLFS; MPN: KMS231GLFS
U5 = STM32N657_223: MPN: STM32N657